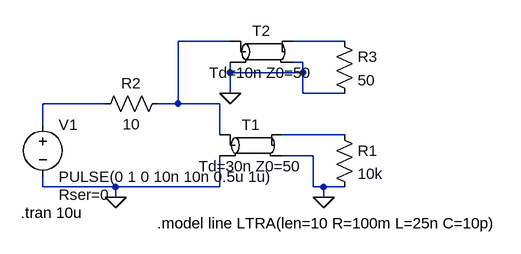
[diagram p0: schematic leitung.asc]
leitung.asc, the LTspice schematic file:
Version 4
SHEET 1 880 680
WIRE 368 -32 288 -32
WIRE 544 -32 464 -32
WIRE 480 0 464 0
WIRE 368 16 368 0
WIRE 480 16 480 0
WIRE 480 16 368 16
WIRE 368 48 368 16
WIRE 480 48 480 16
WIRE 544 48 480 48
WIRE 176 64 80 64
WIRE 288 64 288 -32
WIRE 288 64 256 64
WIRE 352 64 288 64
WIRE 80 96 80 64
WIRE 352 112 352 64
WIRE 544 112 448 112
WIRE 496 144 448 144
WIRE 80 192 80 176
WIRE 192 192 80 192
WIRE 352 192 352 144
WIRE 352 192 192 192
WIRE 496 192 496 144
WIRE 512 192 496 192
WIRE 544 192 512 192
WIRE 192 208 192 192
WIRE 512 208 512 192
FLAG 192 208 0
FLAG 512 208 0
FLAG 368 48 0
SYMBOL voltage 80 80 R0
WINDOW 123 0 0 Left 2
WINDOW 39 24 124 Left 2
SYMATTR InstName V1
SYMATTR Value PULSE(0 1 0 10n 10n 0.5u 1u)
SYMATTR SpiceLine Rser=0
SYMBOL tline 400 128 R0
SYMATTR InstName T1
SYMATTR Value Td=30n Z0=50
SYMBOL res 528 96 R0
SYMATTR InstName R1
SYMATTR Value 10k
SYMBOL res 272 48 R90
WINDOW 0 0 56 VBottom 2
WINDOW 3 32 56 VTop 2
SYMATTR InstName R2
SYMATTR Value 10
SYMBOL res 528 -48 R0
SYMATTR InstName R3
SYMATTR Value 50
SYMBOL tline 416 -16 R0
SYMATTR InstName T2
SYMATTR Value Td=10n Z0=50
TEXT 46 232 Left 2 !.tran 10u
TEXT 256 248 Left 2 !.model line LTRA(len=10 R=100m L=25n C=10p)

The netlist it stands for:
* leitung.asc
V1 N003 0 PULSE(0 1 0 10n 10n 0.5u 1u) Rser=0
T1 N001 0 N004 0 Td=30n Z0=50
R1 N004 0 10k
R2 N001 N003 10
R3 N002 0 50
T2 N001 0 N002 0 Td=10n Z0=50
.tran 10u
.model line LTRA(len=10 R=100m L=25n C=10p)
.backanno
.end